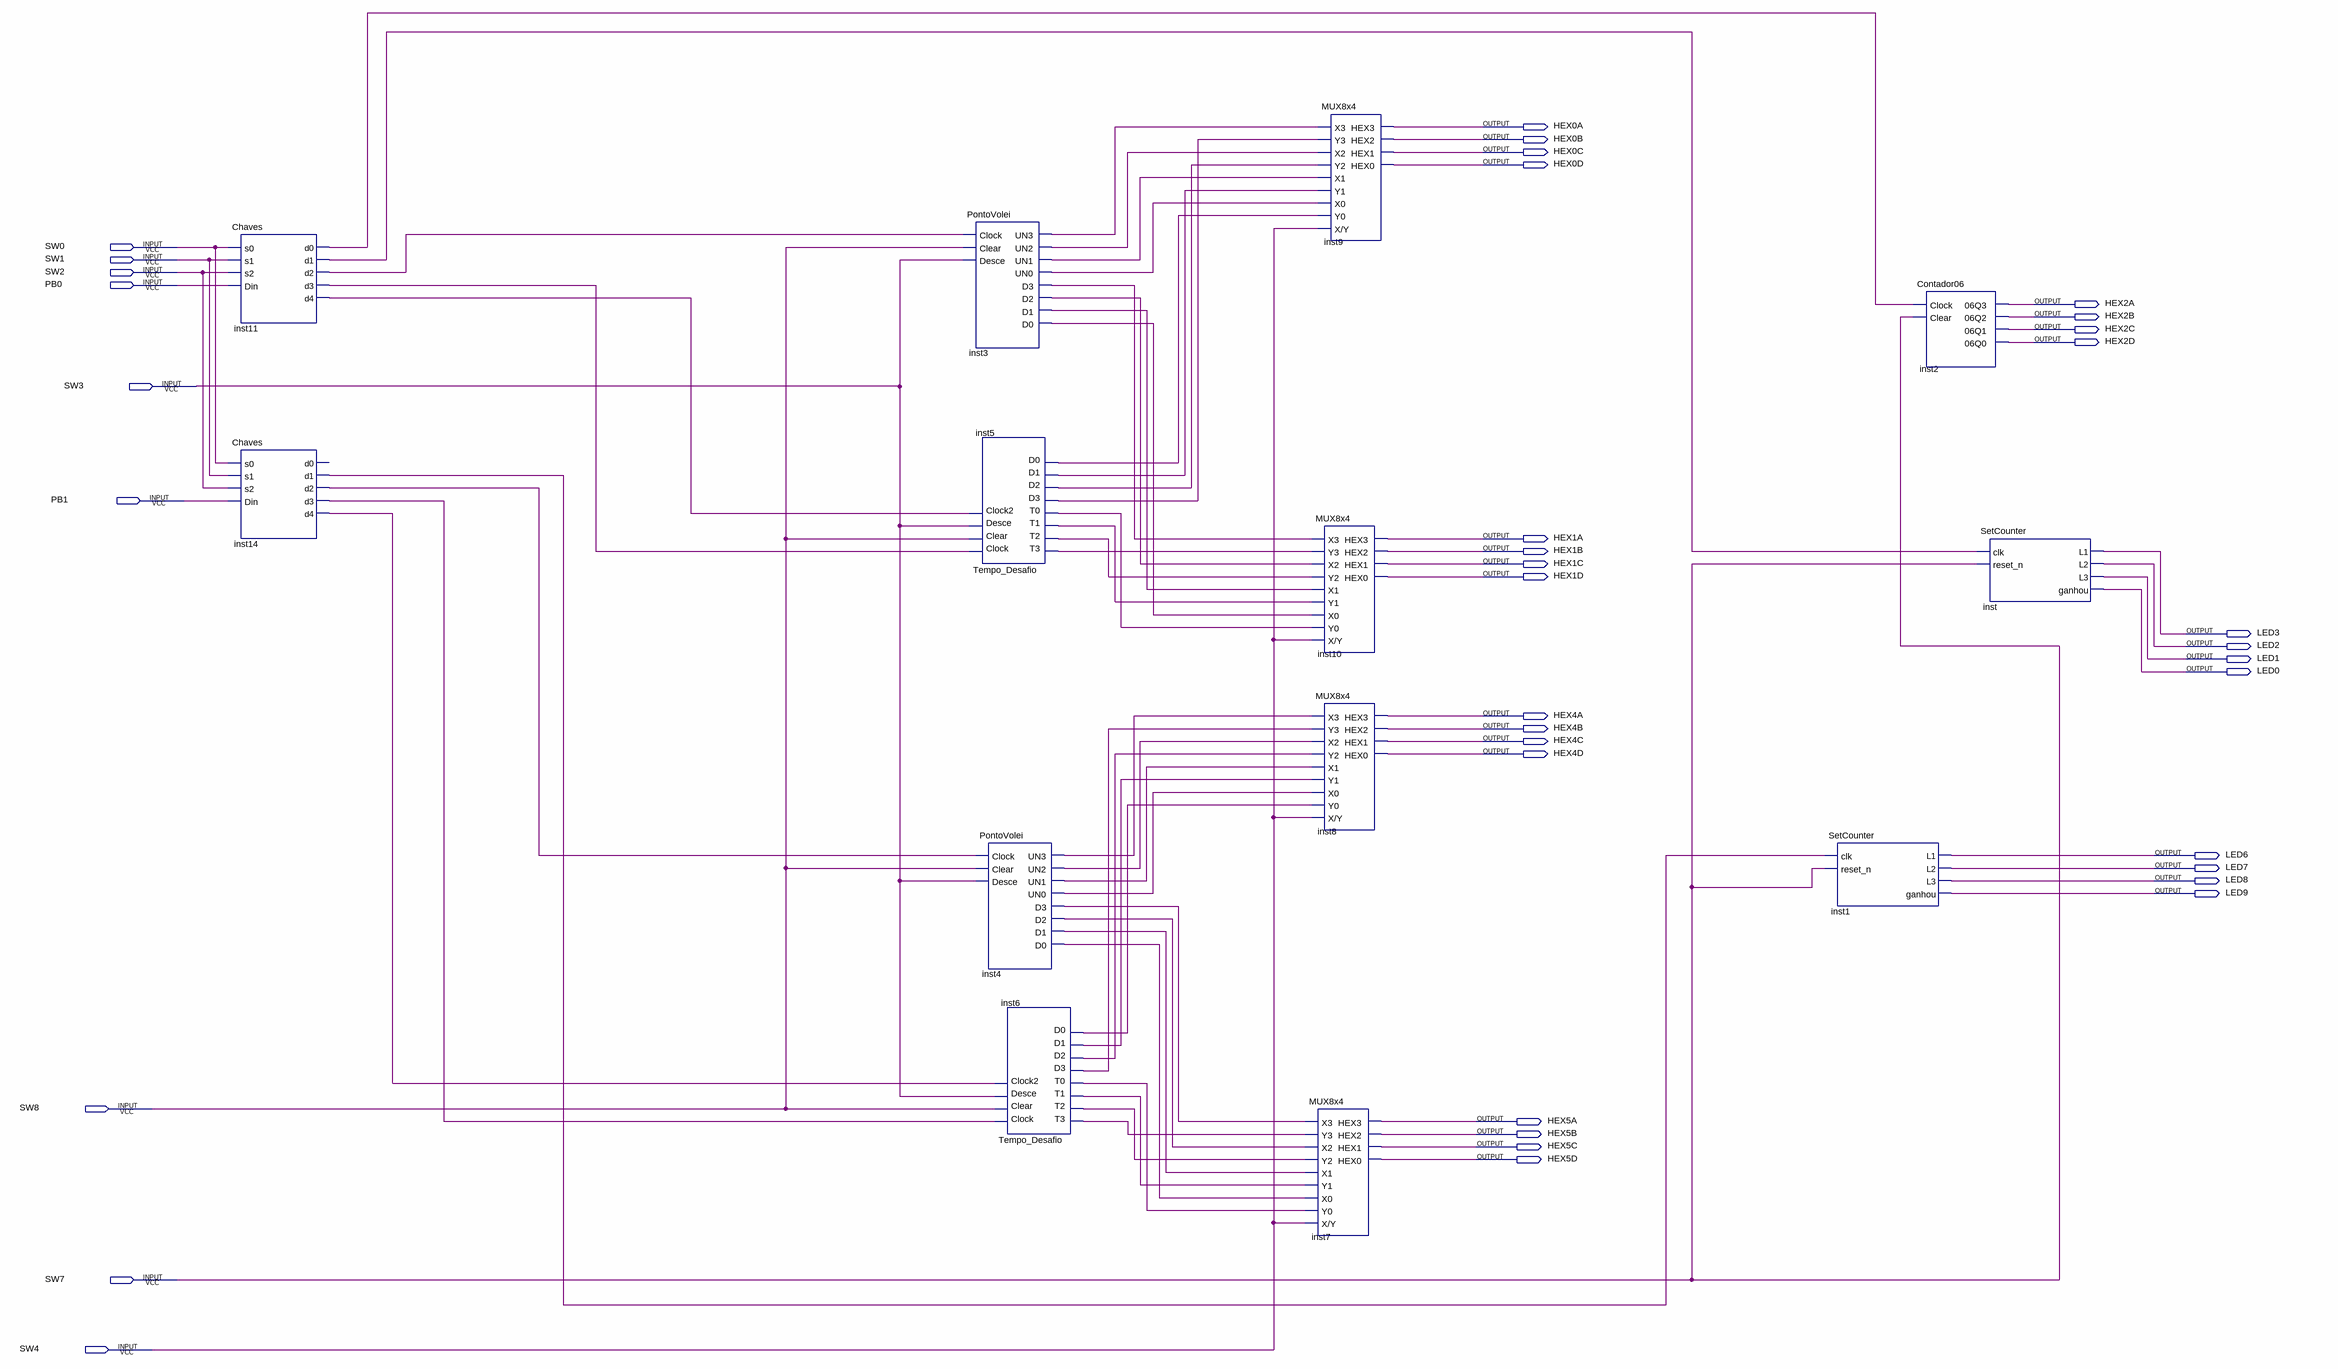
[diagram p0: schematic sheet]
// Quartus schematic PlacarVolei.bdf as structural Verilog: 13 symbols, 37 pins
module PlacarVolei (
  input  SW0,
  input  SW1,
  input  SW2,
  input  PB0,
  input  SW3,
  input  PB1,
  input  SW8,
  input  SW7,
  input  SW4,
  output HEX0A,
  output HEX0B,
  output HEX0C,
  output HEX0D,
  output HEX2A,
  output HEX2B,
  output HEX2C,
  output HEX2D,
  output HEX1A,
  output HEX1B,
  output HEX1C,
  output HEX1D,
  output LED3,
  output LED2,
  output LED1,
  output LED0,
  output HEX4A,
  output HEX4B,
  output HEX4C,
  output HEX4D,
  output LED6,
  output LED7,
  output LED8,
  output LED9,
  output HEX5A,
  output HEX5B,
  output HEX5C,
  output HEX5D
);

  wire inst3_d0, inst3_d1, inst3_d2, inst3_d3, inst3_un0, inst3_un1, inst3_un2, inst3_un3, inst4_d0,
       inst4_d1, inst4_d2, inst4_d3, inst4_un0, inst4_un1, inst4_un2, inst4_un3, inst5_d0, inst5_d1,
       inst5_d2, inst5_d3, inst5_t0, inst5_t1, inst5_t2, inst5_t3, inst6_d0, inst6_d1, inst6_d2, inst6_d3,
       inst6_t0, inst6_t1, inst6_t2, inst6_t3, inst11_d0, inst11_d1, inst11_d2, inst11_d3, inst11_d4,
       inst14_d1, inst14_d2, inst14_d3, inst14_d4;

  Chaves inst11 (
    .s0(SW0), .s1(SW1), .s2(SW2), .Din(PB0), .d0(inst11_d0), .d1(inst11_d1), .d2(inst11_d2), .d3(inst11_d3),
    .d4(inst11_d4));
  Chaves inst14 (
    .s0(SW0), .s1(SW1), .s2(SW2), .Din(PB1), .d1(inst14_d1), .d2(inst14_d2), .d3(inst14_d3), .d4(inst14_d4));  // open: d0
  PontoVolei inst3 (
    .Clock(inst11_d2), .Clear(SW8), .Desce(SW3), .UN3(inst3_un3), .UN2(inst3_un2), .UN1(inst3_un1),
    .UN0(inst3_un0), .D3(inst3_d3), .D2(inst3_d2), .D1(inst3_d1), .D0(inst3_d0));
  Tempo_Desafio inst5 (
    .Clock(inst11_d3), .Clear(SW8), .Desce(SW3), .Clock2(inst11_d4), .T3(inst5_t3), .T2(inst5_t2),
    .T1(inst5_t1), .T0(inst5_t0), .D3(inst5_d3), .D2(inst5_d2), .D1(inst5_d1), .D0(inst5_d0));
  PontoVolei inst4 (
    .Clock(inst14_d2), .Clear(SW8), .Desce(SW3), .UN3(inst4_un3), .UN2(inst4_un2), .UN1(inst4_un1),
    .UN0(inst4_un0), .D3(inst4_d3), .D2(inst4_d2), .D1(inst4_d1), .D0(inst4_d0));
  Tempo_Desafio inst6 (
    .Clock(inst14_d3), .Clear(SW8), .Desce(SW3), .Clock2(inst14_d4), .T3(inst6_t3), .T2(inst6_t2),
    .T1(inst6_t1), .T0(inst6_t0), .D3(inst6_d3), .D2(inst6_d2), .D1(inst6_d1), .D0(inst6_d0));
  MUX8x4 inst9 (
    .X3(inst3_un3), .Y3(inst5_d3), .X2(inst3_un2), .Y2(inst5_d2), .X1(inst3_un1), .Y1(inst5_d1),
    .X0(inst3_un0), .Y0(inst5_d0), .\X/Y (SW4), .HEX3(HEX0A), .HEX2(HEX0B), .HEX1(HEX0C), .HEX0(HEX0D));
  MUX8x4 inst10 (
    .X3(inst3_d3), .Y3(inst5_t3), .X2(inst3_d2), .Y2(inst5_t2), .X1(inst3_d1), .Y1(inst5_t1), .X0(inst3_d0),
    .Y0(inst5_t0), .\X/Y (SW4), .HEX3(HEX1A), .HEX2(HEX1B), .HEX1(HEX1C), .HEX0(HEX1D));
  MUX8x4 inst8 (
    .X3(inst4_un3), .Y3(inst6_d3), .X2(inst4_un2), .Y2(inst6_d2), .X1(inst4_un1), .Y1(inst6_d1),
    .X0(inst4_un0), .Y0(inst6_d0), .\X/Y (SW4), .HEX3(HEX4A), .HEX2(HEX4B), .HEX1(HEX4C), .HEX0(HEX4D));
  MUX8x4 inst7 (
    .X3(inst4_d3), .Y3(inst6_t3), .X2(inst4_d2), .Y2(inst6_t2), .X1(inst4_d1), .Y1(inst6_t1), .X0(inst4_d0),
    .Y0(inst6_t0), .\X/Y (SW4), .HEX3(HEX5A), .HEX2(HEX5B), .HEX1(HEX5C), .HEX0(HEX5D));
  SetCounter inst1 (.clk(inst14_d1), .reset_n(SW7), .L1(LED6), .L2(LED7), .L3(LED8), .ganhou(LED9));
  Contador06 inst2 (.Clock(inst11_d0), .Clear(SW7), .\06Q3 (HEX2A), .\06Q2 (HEX2B), .\06Q1 (HEX2C), .\06Q0 (HEX2D));
  SetCounter inst (.clk(inst11_d1), .reset_n(SW7), .L1(LED3), .L2(LED2), .L3(LED1), .ganhou(LED0));
endmodule
